# Altium schematic sheet USB_ISP1760.SchDoc: USB-host Controller IC
size A3; Organization: Altium Limited.; DocumentNumber: 57; SheetNumber: 58; SheetTotal: 78
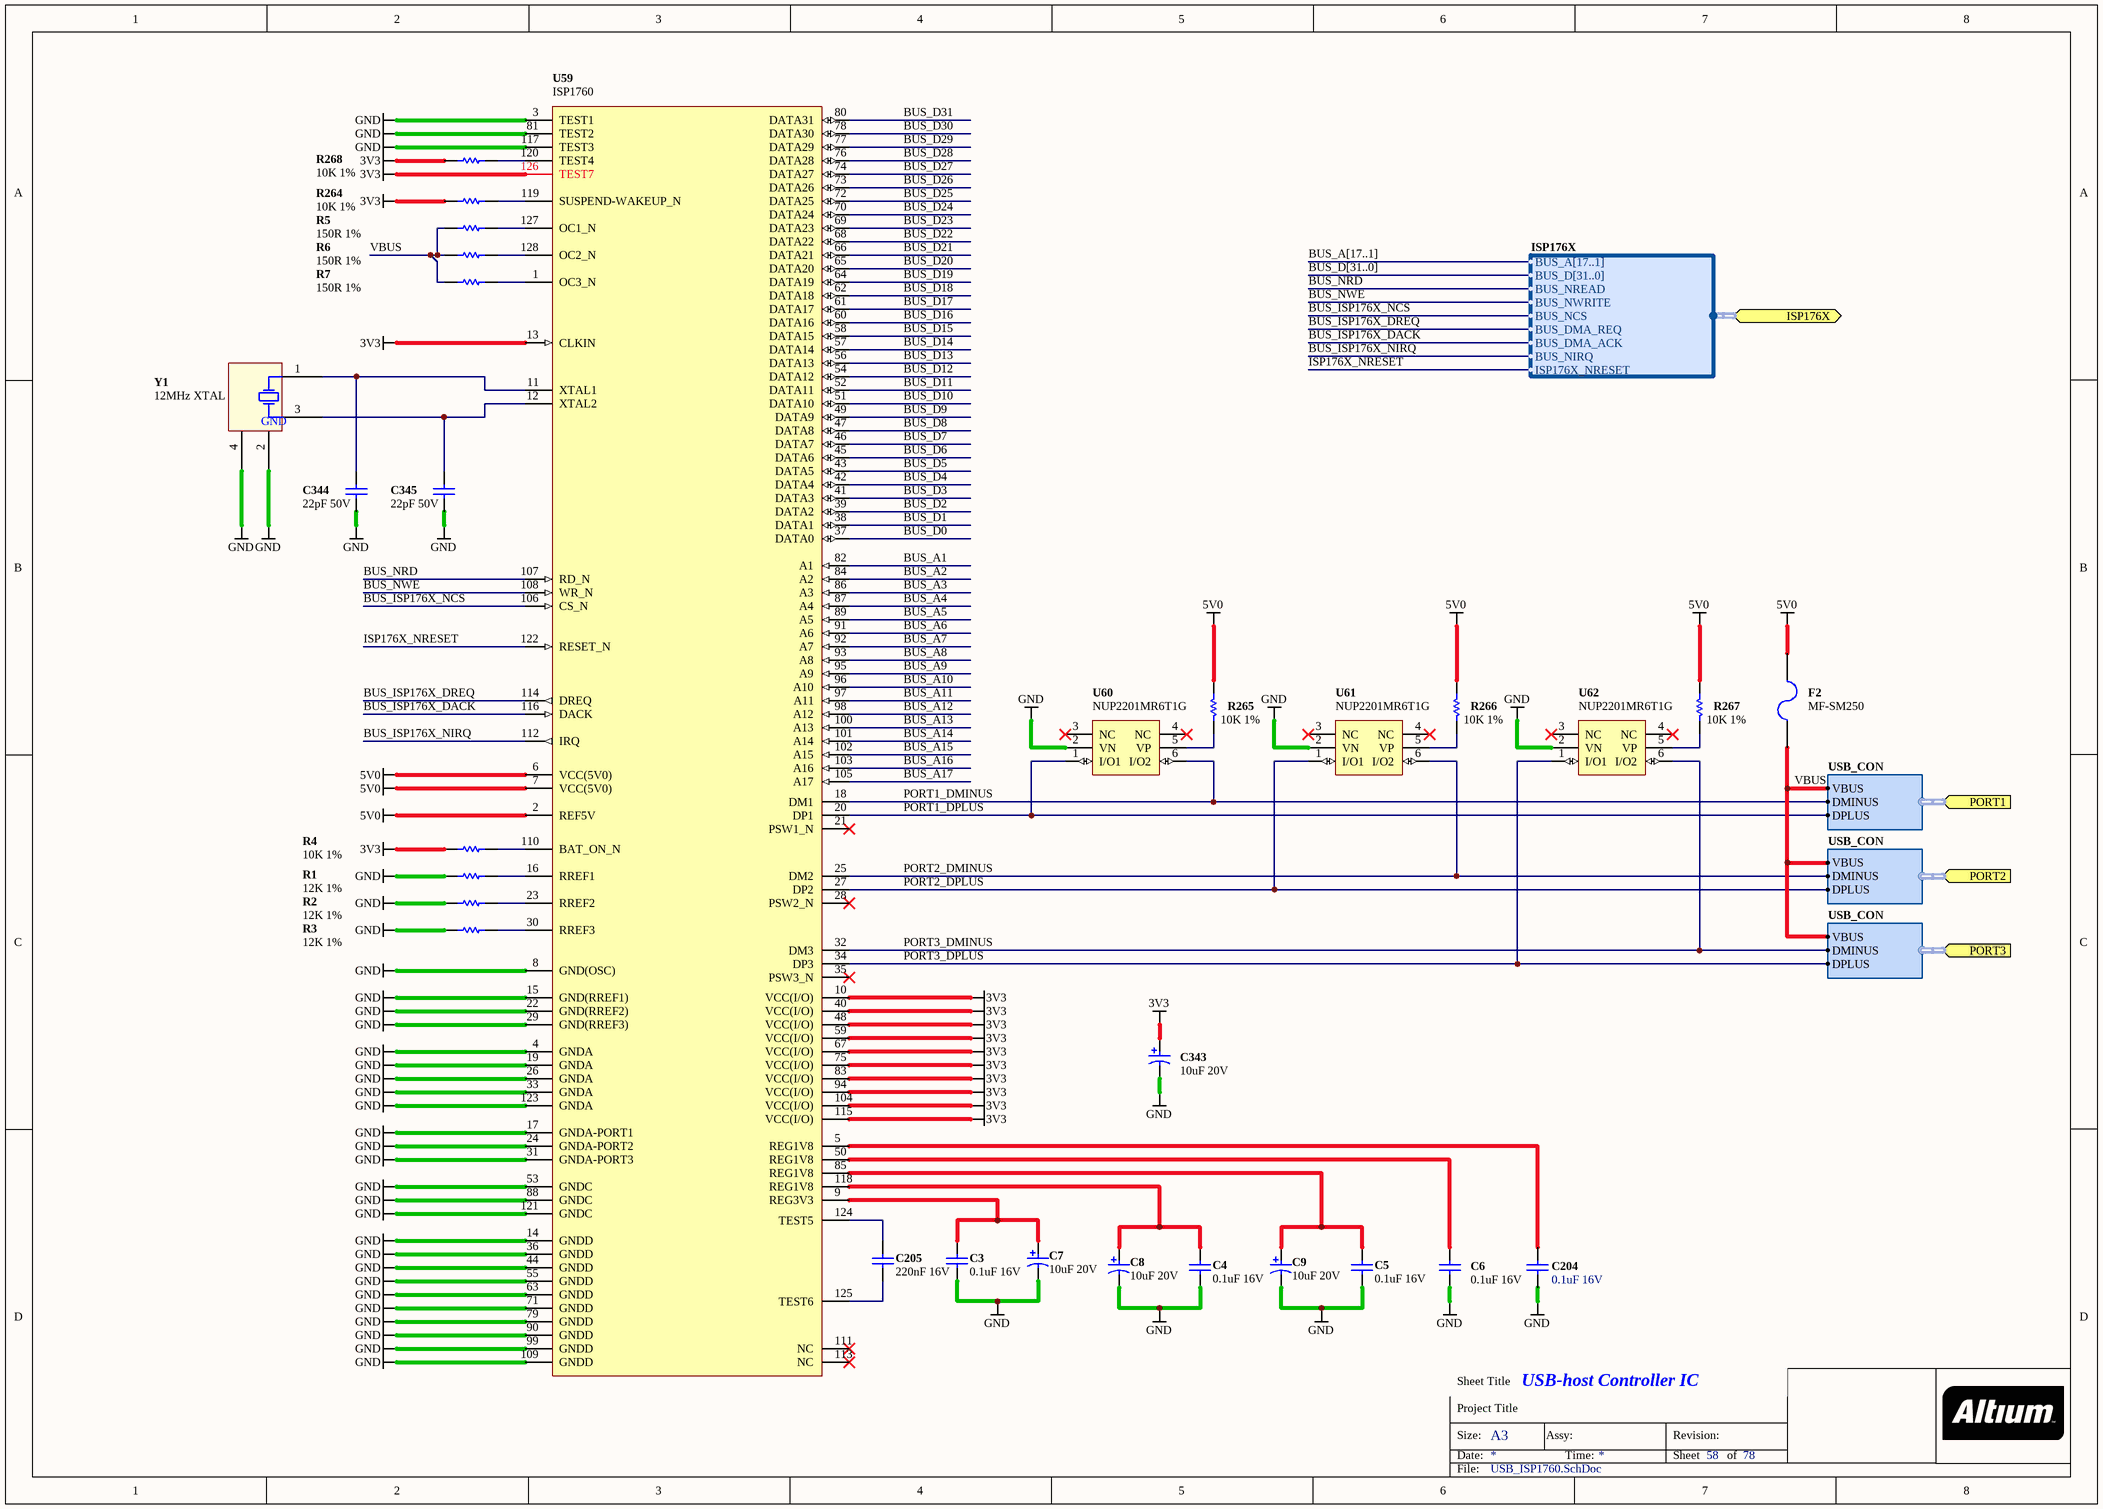
[diagram p0: USB_ISP1760.SchDoc]

## Parts
C3  0.1uF 16V  [CAPC1005-STAR]
C4  0.1uF 16V  [CAPC1005-STAR]
C5  0.1uF 16V  [CAPC1005-STAR]
C6  0.1uF 16V  [CAPC1005-STAR]
C7  10uF 20V  [CAPC3528-STAR]
C8  10uF 20V  [CAPC3528-STAR]
C9  10uF 20V  [CAPC3528-STAR]
C204  0.1uF 16V  [CAPC1005-STAR]
C205  220nF 16V  [CAPC1005-STAR]
C343  10uF 20V  [CAPC3528-STAR]
C344  22pF 50V  [CAPC1005-STAR]
C345  22pF 50V  [CAPC1005-STAR]
F2  MF-SM250  [MF_SM250]
R1  12K 1%  [RESC1005-STAR]
R2  12K 1%  [RESC1005-STAR]
R3  12K 1%  [RESC1005-STAR]
R4  10K 1%  [RESC1005-STAR]
R5  150R 1%  [RESC1005-STAR]
R6  150R 1%  [RESC1005-STAR]
R7  150R 1%  [RESC1005-STAR]
R264  10K 1%  [RESC1005-STAR]
R265  10K 1%  [RESC1005-STAR]
R266  10K 1%  [RESC1005-STAR]
R267  10K 1%  [RESC1005-STAR]
R268  10K 1%  [RESC1005-STAR]
U59  ISP1760  [SOT425-1]
U60  NUP2201MR6T1G  [TSOP95P275-6]
U61  NUP2201MR6T1G  [TSOP95P275-6]
U62  NUP2201MR6T1G  [TSOP95P275-6]
Y1  12MHz XTAL  [XTAL-200X126-4]

## Ports
ISP176X (harness ISP176X), PORT1 (harness USB_CON), PORT2 (harness USB_CON), PORT3 (harness USB_CON)

## Harnesses
USB_CON: VBUS, DMINUS, DPLUS
ISP176X: BUS_A[17..1], BUS_D[31..0], BUS_NREAD, BUS_NCS, BUS_DMA_REQ, BUS_DMA_ACK, BUS_NIRQ, BUS_NWRITE, ISP176X_NRESET

## Nets
3V3: C343.1 R4.2 R264.2 R268.2 U59.10(VCC(I/O)) U59.13(CLKIN) U59.40(VCC(I/O)) U59.48(VCC(I/O)) U59.59(VCC(I/O)) U59.67(VCC(I/O)) U59.75(VCC(I/O)) U59.83(VCC(I/O)) U59.94(VCC(I/O)) U59.104(VCC(I/O)) U59.115(VCC(I/O)) U59.126(TEST7)
5V0: F2.2 R265.2 R266.2 R267.2 U59.2(REF5V) U59.6(VCC(5V0)) U59.7(VCC(5V0))
GND: C3.2 C4.2 C5.2 C6.2 C7.2 C8.2 C9.2 C204.2 C343.2 C344.1 C345.1 R1.2 R2.2 R3.2 U59.3(TEST1) U59.4(GNDA) U59.8(GND(OSC)) U59.14(GNDD) U59.15(GND(RREF1)) U59.17(GNDA-PORT1) U59.19(GNDA) U59.22(GND(RREF2)) U59.24(GNDA-PORT2) U59.26(GNDA) U59.29(GND(RREF3)) U59.31(GNDA-PORT3) U59.33(GNDA) U59.36(GNDD) U59.44(GNDD) U59.53(GNDC) U59.55(GNDD) U59.63(GNDD) U59.71(GNDD) U59.79(GNDD) U59.81(TEST2) U59.88(GNDC) U59.90(GNDD) U59.99(GNDD) U59.109(GNDD) U59.117(TEST3) U59.121(GNDC) U59.123(GNDA) U60.2(VN) U61.2(VN) U62.2(VN) Y1.2(GND) Y1.4(GND)
BUS_A1: U59.82(A1)
BUS_A2: U59.84(A2)
BUS_A3: U59.86(A3)
BUS_A4: U59.87(A4)
BUS_A5: U59.89(A5)
BUS_A6: U59.91(A6)
BUS_A7: U59.92(A7)
BUS_A8: U59.93(A8)
BUS_A9: U59.95(A9)
BUS_A10: U59.96(A10)
BUS_A11: U59.97(A11)
BUS_A12: U59.98(A12)
BUS_A13: U59.100(A13)
BUS_A14: U59.101(A14)
BUS_A15: U59.102(A15)
BUS_A16: U59.103(A16)
BUS_A17: U59.105(A17)
BUS_D0: U59.37(DATA0)
BUS_D1: U59.38(DATA1)
BUS_D2: U59.39(DATA2)
BUS_D3: U59.41(DATA3)
BUS_D4: U59.42(DATA4)
BUS_D5: U59.43(DATA5)
BUS_D6: U59.45(DATA6)
BUS_D7: U59.46(DATA7)
BUS_D8: U59.47(DATA8)
BUS_D9: U59.49(DATA9)
BUS_D10: U59.51(DATA10)
BUS_D11: U59.52(DATA11)
BUS_D12: U59.54(DATA12)
BUS_D13: U59.56(DATA13)
BUS_D14: U59.57(DATA14)
BUS_D15: U59.58(DATA15)
BUS_D16: U59.60(DATA16)
BUS_D17: U59.61(DATA17)
BUS_D18: U59.62(DATA18)
BUS_D19: U59.64(DATA19)
BUS_D20: U59.65(DATA20)
BUS_D21: U59.66(DATA21)
BUS_D22: U59.68(DATA22)
BUS_D23: U59.69(DATA23)
BUS_D24: U59.70(DATA24)
BUS_D25: U59.72(DATA25)
BUS_D26: U59.73(DATA26)
BUS_D27: U59.74(DATA27)
BUS_D28: U59.76(DATA28)
BUS_D29: U59.77(DATA29)
BUS_D30: U59.78(DATA30)
BUS_D31: U59.80(DATA31)
BUS_ISP176X_DACK: U59.116(DACK) ; port ISP176X.BUS_DMA_ACK
BUS_ISP176X_DREQ: U59.114(DREQ) ; port ISP176X.BUS_DMA_REQ
BUS_ISP176X_NCS: U59.106(CS_N) ; port ISP176X.BUS_NCS
BUS_ISP176X_NIRQ: U59.112(IRQ) ; port ISP176X.BUS_NIRQ
BUS_NRD: U59.107(RD_N) ; port ISP176X.BUS_NREAD
BUS_NWE: U59.108(WR_N) ; port ISP176X.BUS_NWRITE
ISP176X_NRESET: U59.122(RESET_N) ; port ISP176X.ISP176X_NRESET
PORT1_DMINUS: U59.18(DM1) U60.6(I/O2) ; port PORT1.DMINUS
PORT1_DPLUS: U59.20(DP1) U60.1(I/O1) ; port PORT1.DPLUS
PORT2_DMINUS: U59.25(DM2) U61.6(I/O2) ; port PORT2.DMINUS
PORT2_DPLUS: U59.27(DP2) U61.1(I/O1) ; port PORT2.DPLUS
PORT3_DMINUS: U59.32(DM3) U62.6(I/O2) ; port PORT3.DMINUS
PORT3_DPLUS: U59.34(DP3) U62.1(I/O1) ; port PORT3.DPLUS
VBUS: F2.1 R5.2 R6.2 R7.2 ; port PORT3.VBUS, port PORT2.VBUS, port PORT1.VBUS
NetC3_1: C3.1 C7.1 U59.9(REG3V3)
NetC4_1: C4.1 C8.1 U59.118(REG1V8)
NetC5_1: C5.1 C9.1 U59.85(REG1V8)
NetC6_1: C6.1 U59.50(REG1V8)
NetC204_1: C204.1 U59.5(REG1V8)
NetC205_1: C205.1 U59.124(TEST5)
NetC205_2: C205.2 U59.125(TEST6)
NetC344_2: C344.2 U59.11(XTAL1) Y1.1(X1)
NetC345_2: C345.2 U59.12(XTAL2) Y1.3(X2)
NetR1_1: R1.1 U59.16(RREF1)
NetR2_1: R2.1 U59.23(RREF2)
NetR3_1: R3.1 U59.30(RREF3)
NetR4_1: R4.1 U59.110(BAT_ON_N)
NetR5_1: R5.1 U59.127(OC1_N)
NetR6_1: R6.1 U59.128(OC2_N)
NetR7_1: R7.1 U59.1(OC3_N)
NetR264_1: R264.1 U59.119(SUSPEND-WAKEUP_N)
NetR265_1: R265.1 U60.5(VP)
NetR266_1: R266.1 U61.5(VP)
NetR267_1: R267.1 U62.5(VP)
NetR268_1: R268.1 U59.120(TEST4)

Not connected (* = marked no-connect by the designer): U59 21(PSW1_N)* 28(PSW2_N)* 35(PSW3_N)* 111(NC)* 113(NC)*; U60 3(NC)* 4(NC)*; U61 3(NC)* 4(NC)*; U62 3(NC)* 4(NC)*

## Buses and harness runs
bus BUS_A[17..1]
bus BUS_D[31..0]

## Notes on the sheet
- Sheet Title
- Project Title
- Size:
- Date:
- A3
- Assy:
- Time:
- Revision:
- Sheet
- of
- File:

## Library data of the parts
C3-C6 C204 = D-101-0080: Capacitor, Ceramic, 0.1uF 10% 16V 0402 (1005) X7R; Polarity: Non-Polarized; Category: Capacitor; Dielectric: X7R; Mounting Technology: Surface Mount; Status: Production; Technology: Ceramic
  C3-C6: Capacitance: 0.1 uF; Rated Voltage: 16 V; Tolerance: 10 %
  C204: Capacitance: 0.1uF; Rated Voltage: 16V; Tolerance: 10%
C7-C9 C343 = D-101-0007: Capacitor, Tantalum, 10uF 10% 20V MCCT-B (3528); Polarity: Polarized; Capacitance: 10 uF; Category: Capacitor; Mounting Technology: Surface Mount; Rated Voltage: 20 V; Status: Production; Technology: Tantalum; Tolerance: 10 %
C205 = D-101-0116: Capacitor, Ceramic, 220nF 10% 16V 0402 (1005) X5R; Polarity: Non-Polarized; Capacitance: 220 nF; Category: Capacitor; Dielectric: X5R; Mounting Technology: Surface Mount; Rated Voltage: 16 V; Status: Production; Technology: Ceramic; Tolerance: 10 %
C344 C345 = D-101-0059: Capacitor, Ceramic, 22pF 5% 50V 0402 (1005) COG; Polarity: Non-Polarized; Capacitance: 22 pF; Category: Capacitor; Dielectric: COG; Mounting Technology: Surface Mount; Rated Voltage: 50 V; Status: Unreleased; Technology: Ceramic; Tolerance: 5 %
F2 = D-106-0000: Mutifuse, SMD 5A; Rated Voltage: 15V; Amperage: 5A; Category: Fuse
R1-R3 = D-100-0002: Resistor, 12K 1% 0402; Power Rating: mW; Resistance: mR; Tolerance: %; Category: Resistor; Mounting Technology: Surface Mount; Status: Unreleased
R4 R264-R268 = D-100-0130: Resistor, 10K 1% 0402 (1005); Power Rating: 63 mW; Category: Resistor; Mounting Technology: Surface Mount; Resistance: 10 K; Status: Production; Tolerance: 1 %
R5-R7 = D-100-0005: Resistor, 150R 1% 0402 (1005); Power Rating: 63mW; Category: Resistor; Mounting Technology: Surface Mount; Resistance: 150R; Status: Unreleased; Tolerance: 1%
U59 = D-221-0018: Hi-Speed Universal Serial Bus host controller; Comm Standard: None; Mounting Technology: Surface Mount; Status: Production; Category: IC-Communication
U60-U62 = D-204-0001: NUP2201MR6, Low Capacitance Diode Array, USB Protection; Max Input Voltage: mV; Max Output Current: mA; Category: IC-Power; Max Output Voltage: mV; Min Input Voltage: mV; Min Output Voltage: mV; Mounting Technology: Surface Mount; Status: Production; Supply Voltage: mV
Y1 = D-103-0000: Crystal, SMD, 12.000000MHz Stab=30ppm 20.0pF; Frequency Stability: 30ppm; Load Capacitance: 20pF; Nominal Operational Voltage: mV; Frequency Tolerance: 30ppm; Mounting Technology: Surface Mount; Nominal Fequency: 12MHz; Status: Production; Category: Crystal